# EAGLE design atmel_modular_expansion (EAGLE 6.4)
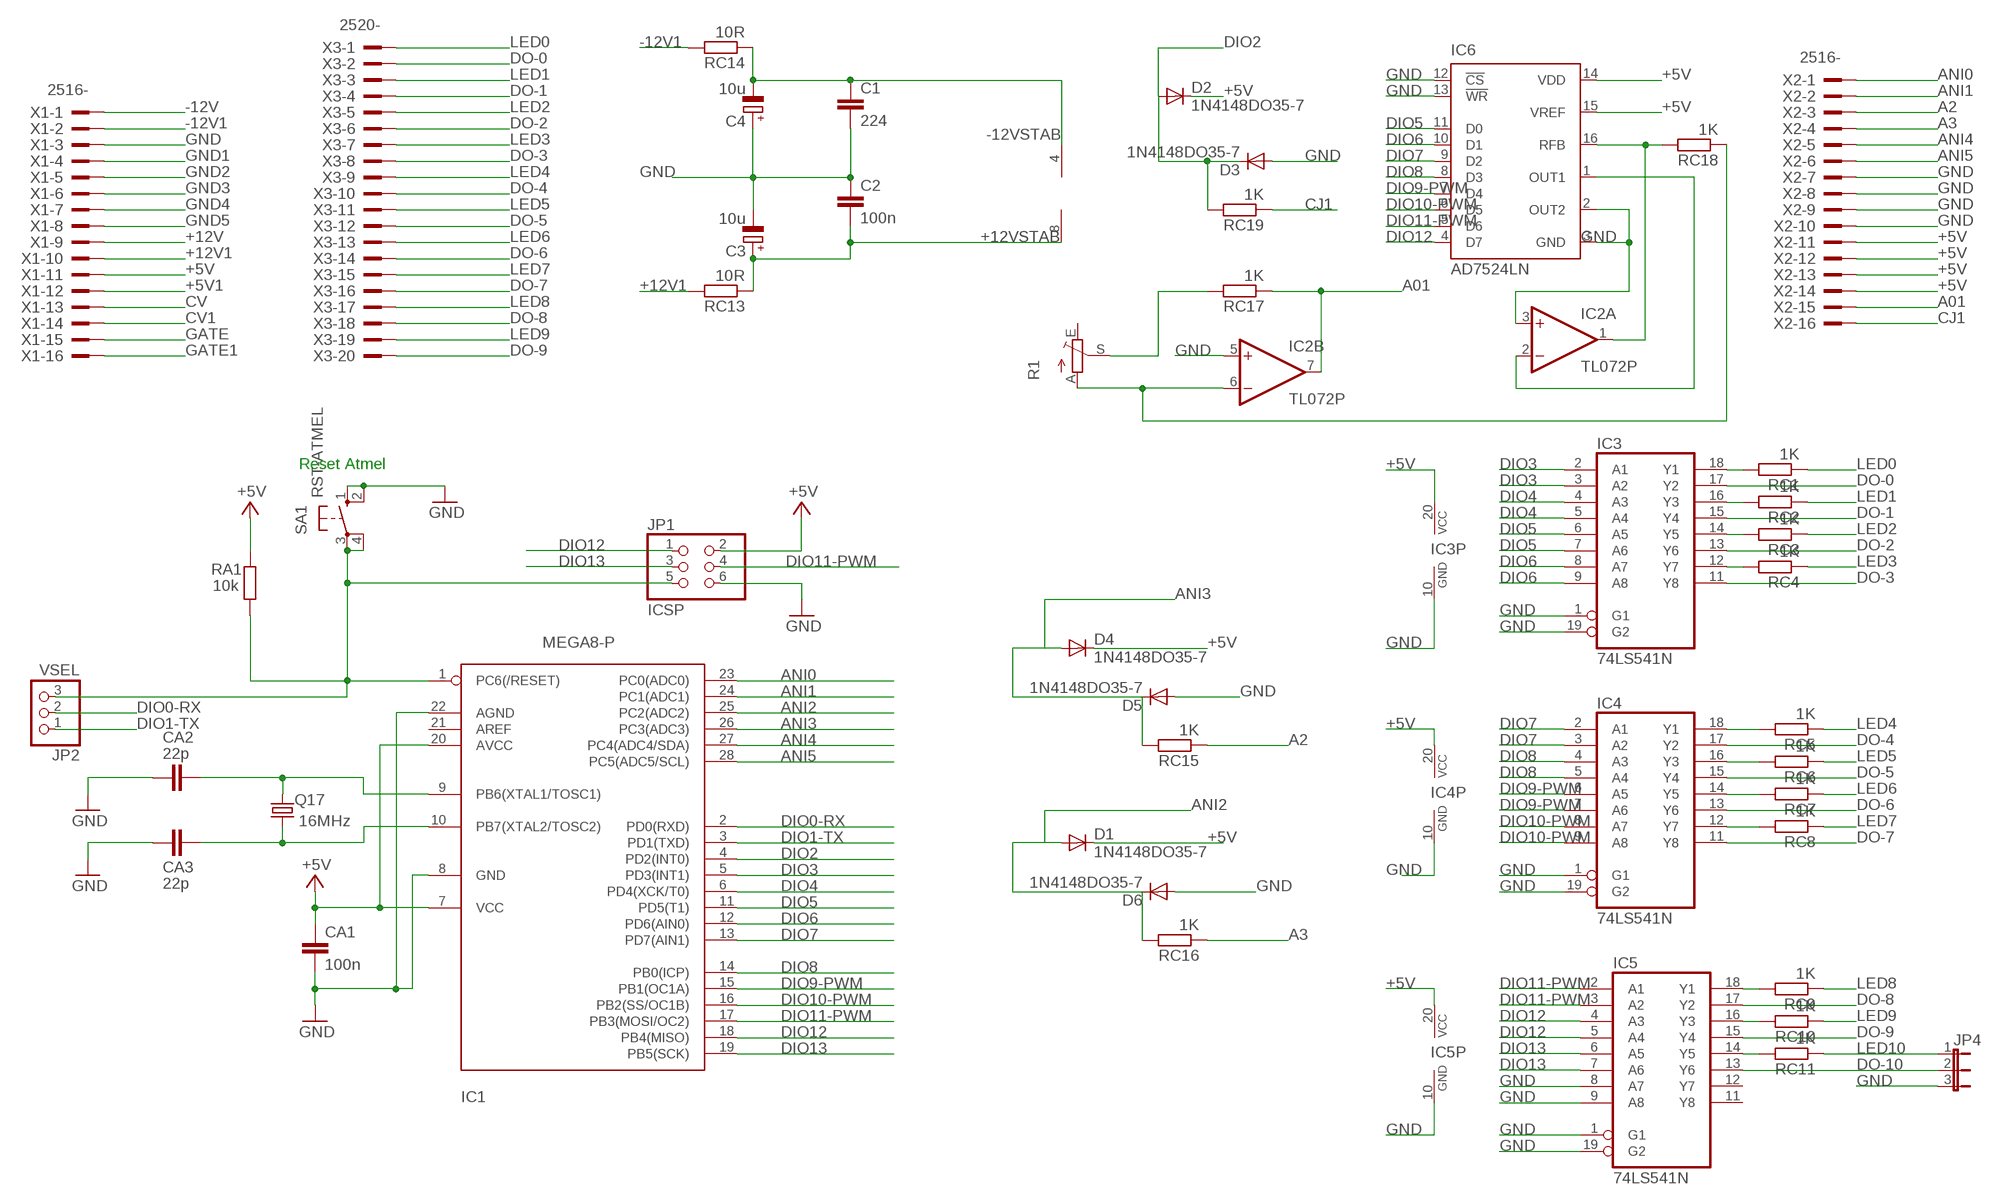
[diagram p0: schematic, sheet 1]

## Parts
C1  224  C-EU050-025X075  [C050-025X075]
C2  100n  C-EU050-025X075  [C050-025X075]
C3  10u  CPOL-EUE2.5-7  [E2,5-7]
C4  10u  CPOL-EUE2.5-7  [E2,5-7]
CA1  100n  C-EU050-025X075  [C050-025X075]
CA2  22p  C-EU050-025X075  [C050-025X075]
CA3  22p  C-EU050-025X075  [C050-025X075]
D1  1N4148DO35-7  [DO35-7]
D2  1N4148DO35-7  [DO35-7]
D3  1N4148DO35-7  [DO35-7]
D4  1N4148DO35-7  [DO35-7]
D5  1N4148DO35-7  [DO35-7]
D6  1N4148DO35-7  [DO35-7]
IC1  MEGA8-P  [DIL28-3]
IC2  TL072P  [DIL08]
IC3  74LS541N  [DIL20]
IC4  74LS541N  [DIL20]
IC5  74LS541N  [DIL20]
IC6  AD7524LN  [DIL16]
JP1  ICSP  PINHD-2X3  [2X03]
JP2  VSEL  PINHD-1X3  [1X03]
JP4  JP2E  [JP2]
Q17  16MHz  CRYSTALHC49S  [HC49/S]
R1  TRIM_EU-B64Y  [B64Y]
RA1  10k  R-EU_0207/10  [0207/10]
RC1  1K  R-EU_0207/10  [0207/10]
RC2  1K  R-EU_0207/10  [0207/10]
RC3  1K  R-EU_0207/10  [0207/10]
RC4  1K  R-EU_0207/10  [0207/10]
RC5  1K  R-EU_0207/10  [0207/10]
RC6  1K  R-EU_0207/10  [0207/10]
RC7  1K  R-EU_0207/10  [0207/10]
RC8  1K  R-EU_0207/10  [0207/10]
RC9  1K  R-EU_0207/10  [0207/10]
RC10  1K  R-EU_0207/10  [0207/10]
RC11  1K  R-EU_0207/10  [0207/10]
RC13  10R  R-EU_0207/10  [0207/10]
RC14  10R  R-EU_0207/10  [0207/10]
RC15  1K  R-EU_0207/10  [0207/10]
RC16  1K  R-EU_0207/10  [0207/10]
RC17  1K  R-EU_0207/10  [0207/10]
RC18  1K  R-EU_0207/10  [0207/10]
RC19  1K  R-EU_0207/10  [0207/10]
SA1  RST-ATMEL  10-XX  [B3F-10XX]
X1  2516-  [PAK100/2500-16]
X2  2516-  [PAK100/2500-16]
X3  2520-  [PAK100/2500-20]

## Nets
+5V [Power]: CA1.1 D1.C D2.C D4.C IC1.7(VCC) IC1.20(AVCC) IC3.20(VCC) IC4.20(VCC) IC5.20(VCC) IC6.14(VDD) IC6.15(VREF) JP1.2 RA1.1 X1.11 X2.11 X2.12 X2.13 X2.14
+5V1: X1.12
+12V: X1.9
+12V1: RC13.2 X1.10
+12VSTAB: C2.2 C3.+ IC2.8(P:V+) RC13.1
-12V: X1.1
-12V1: RC14.2 X1.2
-12VSTAB: C1.1 C4.- IC2.4(P:V-) RC14.1
A01: IC2.7(B:OUT) RC17.1 X2.15
A2: RC15.1 X2.3
A3: RC16.1 X2.4
ANI0: IC1.23(PC0(ADC0)) X2.1
ANI1: IC1.24(PC1(ADC1)) X2.2
ANI2: D1.A D6.C IC1.25(PC2(ADC2)) RC16.2
ANI3: D4.A D5.C IC1.26(PC3(ADC3)) RC15.2
ANI4: IC1.27(PC4(ADC4/SDA)) X2.5
ANI5: IC1.28(PC5(ADC5/SCL)) X2.6
CJ1: RC19.1 X2.16
CV: X1.13
CV1: X1.14
DIO0-RX: IC1.2(PD0(RXD)) JP2.2
DIO1-TX: IC1.3(PD1(TXD)) JP2.1
DIO2: D2.A D3.C IC1.4(PD2(INT0)) RC19.2
DIO3: IC1.5(PD3(INT1)) IC3.2(A1) IC3.3(A2)
DIO4: IC1.6(PD4(XCK/T0)) IC3.4(A3) IC3.5(A4)
DIO5: IC1.11(PD5(T1)) IC3.6(A5) IC3.7(A6) IC6.11(D0)
DIO6: IC1.12(PD6(AIN0)) IC3.8(A7) IC3.9(A8) IC6.10(D1)
DIO7: IC1.13(PD7(AIN1)) IC4.2(A1) IC4.3(A2) IC6.9(D2)
DIO8: IC1.14(PB0(ICP)) IC4.4(A3) IC4.5(A4) IC6.8(D3)
DIO9-PWM: IC1.15(PB1(OC1A)) IC4.6(A5) IC4.7(A6) IC6.7(D4)
DIO10-PWM: IC1.16(PB2(SS/OC1B)) IC4.8(A7) IC4.9(A8) IC6.6(D5)
DIO11-PWM: IC1.17(PB3(MOSI/OC2)) IC5.2(A1) IC5.3(A2) IC6.5(D6) JP1.4
DIO12: IC1.18(PB4(MISO)) IC5.4(A3) IC5.5(A4) IC6.4(D7) JP1.1
DIO13: IC1.19(PB5(SCK)) IC5.6(A5) IC5.7(A6) JP1.3
DO-0: IC3.17(Y2) X3.2
DO-1: IC3.15(Y4) X3.4
DO-2: IC3.13(Y6) X3.6
DO-3: IC3.11(Y8) X3.8
DO-4: IC4.17(Y2) X3.10
DO-5: IC4.15(Y4) X3.12
DO-6: IC4.13(Y6) X3.14
DO-7: IC4.11(Y8) X3.16
DO-8: IC5.17(Y2) X3.18
DO-9: IC5.15(Y4) X3.20
DO-10: IC5.13(Y6) JP4.2
GATE: X1.15
GATE1: X1.16
GND: C1.2 C2.1 C3.- C4.+ CA1.2 CA2.2 CA3.2 D3.A D5.A D6.A IC1.8(GND) IC1.22(AGND) IC2.3(A:+IN) IC2.5(B:+IN) IC3.1(G1) IC3.10(GND) IC3.19(G2) IC4.1(G1) IC4.10(GND) IC4.19(G2) IC5.1(G1) IC5.8(A7) IC5.9(A8) IC5.10(GND) IC5.19(G2) IC6.2(OUT2) IC6.3(GND) IC6.12(!CS) IC6.13(!WR) JP1.6 JP4.3 SA1.1(S) SA1.2(S1) X1.3 X2.7 X2.8 X2.9 X2.10
GND1: X1.4
GND2: X1.5
GND3: X1.6
GND4: X1.7
GND5: X1.8
LED0: RC1.1 X3.1
LED1: RC2.1 X3.3
LED2: RC3.1 X3.5
LED3: RC4.1 X3.7
LED4: RC5.1 X3.9
LED5: RC6.1 X3.11
LED6: RC7.1 X3.13
LED7: RC8.1 X3.15
LED8: RC9.1 X3.17
LED9: RC10.1 X3.19
LED10: JP4.1 RC11.1
N$1: IC3.18(Y1) RC1.2
N$3: IC3.16(Y3) RC2.2
N$4: IC3.14(Y5) RC3.2
N$5: CA2.1 IC1.9(PB6(XTAL1/TOSC1)) Q17.2
N$6: CA3.1 IC1.10(PB7(XTAL2/TOSC2)) Q17.1
N$7: IC3.12(Y7) RC4.2
N$8: IC4.18(Y1) RC5.2
N$9: IC4.16(Y3) RC6.2
N$10: IC4.14(Y5) RC7.2
N$11: IC4.12(Y7) RC8.2
N$12: IC5.18(Y1) RC9.2
N$13: IC5.16(Y3) RC10.2
N$14: IC5.14(Y5) RC11.2
N$17: IC2.6(B:-IN) R1.A RC18.1
N$18: IC2.2(A:-IN) IC6.1(OUT1)
N$19: R1.S RC17.2
N$20: IC2.1(A:OUT) IC6.16(RFB) RC18.2
RST: IC1.1(PC6(/RESET)) JP1.5 JP2.3 RA1.2 SA1.3(P) SA1.4(P1)
Unconnected: IC1.21(AREF) IC5.11(Y8) IC5.12(Y7) R1.E

## Notes on the sheet
- Reset Atmel

## Library data of the parts
C1 C2 CA1-CA3 = rcl:C-EU: CAPACITOR, European symbol
C3 C4 = rcl:CPOL-EU: POLARIZED CAPACITOR, European symbol
D1-D6 = diode:1N4148: DIODE high speed (Philips)
IC1 = atmel:MEGA8-P: MICROCONTROLLER 8 Kbytes FLASH, 1 kbytes SRAM, 512 bytes EEPROM, USART, 4-channel 10 bit ADC, 2-channel 8 bit ADC Pin compatible with Atmega48, ATMega88, ATMega168 Source: avr.lbr
IC2 = linear:TL072: OP AMP
IC3-IC5 = 74xx-eu:74*541: Octal BUFFER and LINE DRIVER, 3-state
IC6 = analog-devices:AD7524*: 8-Bit Buffered Multiplying DAC Source: http://www.analog.com/UploadedFiles/Data_Sheets/888358036ad7524.pdf; MF: ALTERA CORPORATION; MPN: AD7524LNZ; OC_FARNELL: 9605401; OC_NEWARK: 59K4974
JP1 = pinhead:PINHD-2X3: PIN HEADER
JP2 = pinhead:PINHD-1X3: PIN HEADER
JP4 = jumper:JP2E: JUMPER
Q17 = crystal:CRYSTAL: CRYSTAL
R1 = pot:TRIM_EU-: POTENTIOMETER
RA1 RC1-RC11 RC13-RC19 = rcl:R-EU_: RESISTOR, European symbol
SA1 = switch-omron:10-XX: OMRON SWITCH
X1 X2 = con-3m:2516-: 3M (TM) Pak 100 4-Wall Header Source: 3M; OC_FARNELL: unknown; OC_NEWARK: unknown
X3 = con-3m:2520-: 3M (TM) Pak 100 4-Wall Header Source: 3M; OC_FARNELL: unknown; OC_NEWARK: unknown

## Net classes
1 Leds: width 0.61 mm, drill 0.508 mm, clearance 0.305 mm
2 Power: width 0.61 mm, drill 0.508 mm, clearance 0.305 mm

## Board
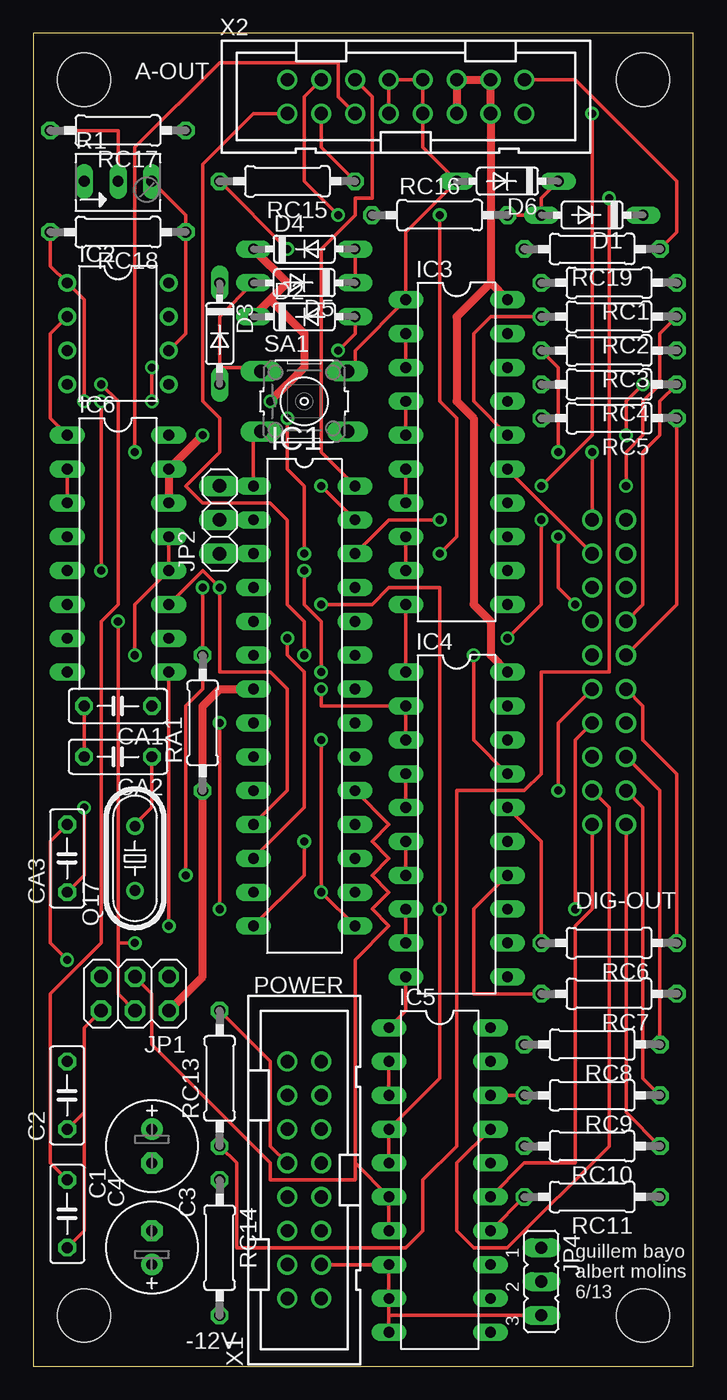
[diagram p1: board, top side]
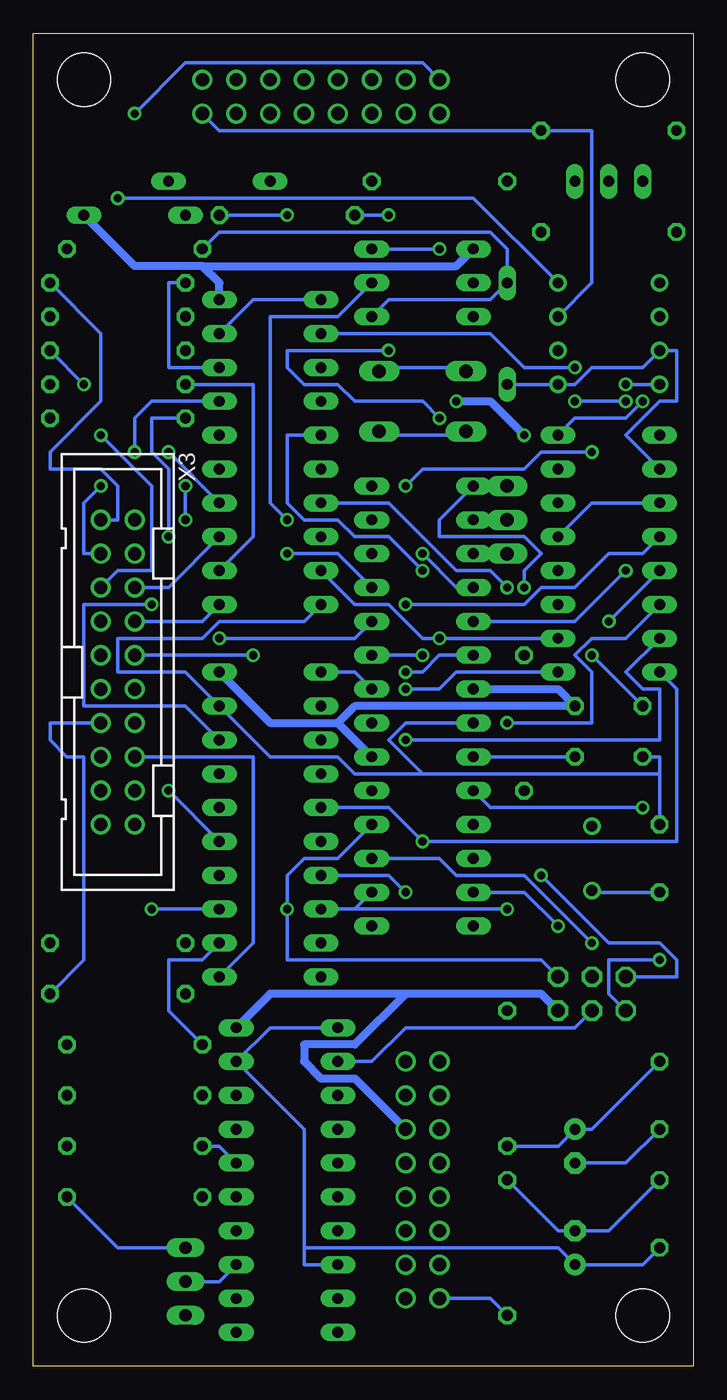
[diagram p2: board, bottom side, seen from below]

Size 49.51 x 100 mm. Coordinates in mm from the lower left corner, seen from the top.
Outline: 0,0 49.51,0 49.51,100 0,100 0,0
Copper layers (1*16): Top 0.035mm / dielectric 1.5mm / Bottom 0.035mm
Design rules "default": minimum track width 10mil, minimum drill 24mil, track to track 8mil, track to pad 8mil, pad to pad 8mil, via to via 8mil, smd to smd 8mil, copper to edge 40mil, drill to drill 8mil, minimum pad ring 10mil, minimum via ring 8mil, stop-mask expansion 4mil, vias tented up to drill 0mil, thermal gap 10mil
Holes 4 mm at 3.81,96.52 45.72,96.52 3.81,3.81 45.72,3.81

### Footprints (pad centres in the part's own frame; a part is rotated, then mirrored left to right if it is on the bottom)
C050-025X075 = drill 0.813 octagon: 1 -2.54,0; 2 2.54,0
E2,5-7 = drill 0.813 pad 1.6: + -1.27,0 | drill 0.813 pad 1.6 octagon: - 1.27,0
DO35-7 = drill 0.813 long: A 3.81,0; C -3.81,0
DIL28-3 = drill 0.813 long: 1 -16.51,-3.81; 2 -13.97,-3.81; 3 -11.43,-3.81; 4 -8.89,-3.81; 5 -6.35,-3.81; 6 -3.81,-3.81; 7 -1.27,-3.81; 8 1.27,-3.81; 9 3.81,-3.81; 10 6.35,-3.81; 11 8.89,-3.81; 12 11.43,-3.81; 13 13.97,-3.81; 14 16.51,-3.81; 15 16.51,3.81; 16 13.97,3.81; 17 11.43,3.81; 18 8.89,3.81; 19 6.35,3.81; 20 3.81,3.81; 21 1.27,3.81; 22 -1.27,3.81; 23 -3.81,3.81; 24 -6.35,3.81; 25 -8.89,3.81; 26 -11.43,3.81; 27 -13.97,3.81; 28 -16.51,3.81
DIL08 = drill 0.813 pad 1.27: 1 -3.81,-3.81; 2 -1.27,-3.81; 3 1.27,-3.81; 4 3.81,-3.81; 5 3.81,3.81; 6 1.27,3.81; 7 -1.27,3.81; 8 -3.81,3.81
DIL20 = drill 0.813 long: 1 -11.43,-3.81; 2 -8.89,-3.81; 3 -6.35,-3.81; 4 -3.81,-3.81; 5 -1.27,-3.81; 6 1.27,-3.81; 7 3.81,-3.81; 8 6.35,-3.81; 9 8.89,-3.81; 10 11.43,-3.81; 11 11.43,3.81; 12 8.89,3.81; 13 6.35,3.81; 14 3.81,3.81; 15 1.27,3.81; 16 -1.27,3.81; 17 -3.81,3.81; 18 -6.35,3.81; 19 -8.89,3.81; 20 -11.43,3.81
DIL16 = drill 0.813 long: 1 -8.89,-3.81; 2 -6.35,-3.81; 3 -3.81,-3.81; 4 -1.27,-3.81; 5 1.27,-3.81; 6 3.81,-3.81; 7 6.35,-3.81; 8 8.89,-3.81; 9 8.89,3.81; 10 6.35,3.81; 11 3.81,3.81; 12 1.27,3.81; 13 -1.27,3.81; 14 -3.81,3.81; 15 -6.35,3.81; 16 -8.89,3.81
2X03 = drill 1.016 octagon: 1 -2.54,-1.27; 2 -2.54,1.27; 3 0,-1.27; 4 0,1.27; 5 2.54,-1.27; 6 2.54,1.27
1X03 = drill 1.016 long: 1 -2.54,0; 2 0,0; 3 2.54,0
JP2 = drill 0.914 long: 1 -2.54,0; 2 0,0; 3 2.54,0
HC49/S = drill 0.813: 1 -2.413,0; 2 2.413,0
B64Y = drill 0.813 long: A 2.54,0; E -2.54,0; S 0,0
0207/10 = drill 0.813 octagon: 1 -5.08,0; 2 5.08,0
B3F-10XX = drill 1.016 long: 1 -3.251,2.261; 2 3.251,2.261; 3 -3.251,-2.261; 4 3.251,-2.261
PAK100/2500-16 = drill 1 pad 1.422: 1 -8.89,-1.27; 2 -8.89,1.27; 3 -6.35,-1.27; 4 -6.35,1.27; 5 -3.81,-1.27; 6 -3.81,1.27; 7 -1.27,-1.27; 8 -1.27,1.27; 9 1.27,-1.27; 10 1.27,1.27; 11 3.81,-1.27; 12 3.81,1.27; 13 6.35,-1.27; 14 6.35,1.27; 15 8.89,-1.27; 16 8.89,1.27
PAK100/2500-20 = drill 1 pad 1.422: 1 -11.43,-1.27; 2 -11.43,1.27; 3 -8.89,-1.27; 4 -8.89,1.27; 5 -6.35,-1.27; 6 -6.35,1.27; 7 -3.81,-1.27; 8 -3.81,1.27; 9 -1.27,-1.27; 10 -1.27,1.27; 11 1.27,-1.27; 12 1.27,1.27; 13 3.81,-1.27; 14 3.81,1.27; 15 6.35,-1.27; 16 6.35,1.27; 17 8.89,-1.27; 18 8.89,1.27; 19 11.43,-1.27; 20 11.43,1.27

### Placement (x,y rotation side)
C1  2.54,11.43 270 top
C2  2.54,20.32 90 top
C3  8.89,16.51 270 top
C4  8.89,8.89 90 top
CA1  6.35,49.53 180 top
CA2  6.35,45.72 180 top
CA3  2.54,38.1 90 top
D1  41.91,86.36 180 top
D2  20.32,78.74 0 top
D3  13.97,77.47 270 top
D4  20.32,83.82 0 top
D5  20.32,81.28 180 top
D6  35.56,88.9 180 top
IC1  20.32,49.53 270 top
IC2  6.35,77.47 270 top
IC3  31.75,68.58 270 top
IC4  31.75,40.64 270 top
IC5  30.48,13.97 270 top
IC6  6.35,60.96 270 top
JP1  7.62,27.94 180 top
JP2  13.97,63.5 90 top
JP4  38.1,6.35 270 top
Q17  7.62,38.1 90 top
R1  6.35,88.9 0 top
RA1  12.7,48.26 90 top
RC1  43.18,81.28 180 top
RC2  43.18,78.74 180 top
RC3  43.18,76.2 180 top
RC4  43.18,73.66 180 top
RC5  43.18,71.12 180 top
RC6  43.18,31.75 180 top
RC7  43.18,27.94 180 top
RC8  41.91,24.13 180 top
RC9  41.91,20.32 180 top
RC10  41.91,16.51 180 top
RC11  41.91,12.7 180 top
RC13  13.97,21.59 90 top
RC14  13.97,8.89 270 top
RC15  19.05,88.9 180 top
RC16  30.48,86.36 0 top
RC17  6.35,92.71 180 top
RC18  6.35,85.09 180 top
RC19  41.91,83.82 180 top
SA1  20.32,72.39 0 top
X1  20.32,13.97 90 top
X2  27.94,95.25 0 top
X3  43.18,52.07 270 bottom

### Tracks (layer width: path | path; a pad name or v marks a point on that pad's centre or on a via)
+5V  (via drill 0.61)
  Top 0.61: JP1.2 12.7,29.21 RA1.1 12.7,49.53 13.97,50.8 IC1.7 | IC6.14 IC6.15 v12.7,69.85 | 17.78,80.01 19.05,81.28 D4.C | 17.78,80.01 D2.C | v17.78,72.39 20.32,74.93 20.32,77.47 17.78,80.01 | X2.11 X2.12 X2.14 X2.13 34.29,81.28 | 34.29,81.28 IC3.20 | IC4.20 34.29,53.34 34.29,55.88 33.02,57.15 33.02,71.12 31.75,72.39 31.75,78.74 34.29,81.28
  Bottom 0.61: 26.67,48.26 IC1.20 | 26.67,48.26 31.75,48.26 IC4.20 | IC1.7 10.16,50.8 CA1.1 25.4,49.53 26.67,48.26 | IC5.20 31.75,27.94 21.59,27.94 | 21.59,27.94 11.43,27.94 JP1.2 | X1.11 25.4,21.59 27.94,21.59 29.21,22.86 29.21,24.13 25.4,24.13 21.59,27.94 | v12.7,69.85 15.24,72.39 v17.78,72.39 | D1.C 41.91,82.55 36.83,82.55 | 36.83,82.55 35.56,81.28 IC3.20 | D4.C 17.78,82.55 36.83,82.55
+12V1
  Top 0.254: RC13.2 17.78,22.86 17.78,16.51 X1.10
+12VSTAB  (via drill 0.61)
  Top 0.254: v43.18,87.63 43.18,52.07 38.1,52.07 38.1,44.45 36.83,43.18 31.75,43.18 31.75,16.51 29.21,13.97 29.21,10.16 27.94,8.89 15.24,8.89 15.24,15.24 RC13.1
  Bottom 0.254: C2.2 7.62,17.78 C3.+ 10.16,16.51 RC13.1 | IC2.8 16.51,87.63 v43.18,87.63
-12V1
  Bottom 0.254: RC14.2 15.24,5.08 X1.2
-12VSTAB  (via drill 0.61)
  Top 0.254: v5.08,73.66 6.35,72.39 6.35,57.15 5.08,55.88 5.08,31.75 1.27,27.94 1.27,15.24 C1.1
  Bottom 0.254: C1.1 6.35,10.16 C4.- 10.16,10.16 RC14.1 | v5.08,73.66 IC2.4
A01
  Bottom 0.254: IC2.7 7.62,81.28 7.62,92.71 RC17.1 35.56,92.71 X2.15
A2
  Top 0.254: RC15.1 21.59,91.44 X2.3
A3  (via drill 0.61)
  Top 0.254: v22.86,86.36 20.32,88.9 20.32,95.25 X2.4
  Bottom 0.254: v22.86,86.36 RC16.1
ANI0  (via drill 0.61)
  Top 0.254: v20.32,53.34 20.32,55.88 19.05,57.15 19.05,63.5 17.78,64.77 12.7,64.77 11.43,66.04 13.97,68.58 13.97,71.12 12.7,72.39 12.7,90.17 16.51,93.98 X2.1
  Bottom 0.254: v20.32,53.34 IC1.23
ANI1  (via drill 0.61)
  Top 0.254: v35.56,54.61 38.1,57.15 v38.1,63.5 | v38.1,66.04 41.91,69.85 v41.91,93.98
  Bottom 0.254: IC1.24 25.4,54.61 v35.56,54.61 | v38.1,66.04 v38.1,63.5 | v41.91,93.98 38.1,97.79 20.32,97.79 X2.2
ANI2  (via drill 0.61)
  Top 0.254: v30.48,60.96 31.75,62.23 31.75,71.12 30.48,72.39 v30.48,86.36 | RC16.2 D1.A 38.1,87.63 D6.C
  Bottom 0.254: IC1.25 26.67,60.96 v30.48,60.96 | RC16.2 v30.48,86.36
ANI3  (via drill 0.61)
  Top 0.254: IC1.26 26.67,63.5 v30.48,63.5 | D5.C D4.A | v19.05,83.82 RC15.2
  Bottom 0.254: v30.48,63.5 31.75,64.77 31.75,78.74 26.67,78.74 D5.C | D4.A v19.05,83.82
ANI4  (via drill 0.61)
  Top 0.254: v21.59,66.04 IC1.27 | v7.62,68.58 7.62,91.44 13.97,97.79 22.86,97.79 22.86,95.25 X2.5
  Bottom 0.254: v21.59,66.04 20.32,67.31 12.7,67.31 11.43,68.58 v7.62,68.58
ANI5
  Top 0.254: IC1.28 21.59,68.58 21.59,83.82 24.13,86.36 24.13,87.63 25.4,87.63 25.4,95.25 X2.6
CJ1
  Top 0.254: RC19.1 48.26,85.09 48.26,88.9 40.64,96.52 X2.16
DIO0-RX
  Top 0.254: JP2.2 IC1.2
DIO1-TX
  Top 0.254: JP2.1 IC1.3
DIO2  (via drill 0.61)
  Top 0.254: v20.32,60.96 20.32,66.04 19.05,67.31 v19.05,71.12 | v22.86,76.2 24.13,77.47 D2.A
  Bottom 0.254: IC1.4 17.78,58.42 v20.32,60.96 | v19.05,71.12 20.32,72.39 25.4,72.39 26.67,73.66 29.21,73.66 30.48,74.93 30.48,76.2 v22.86,76.2 | D2.A 22.86,80.01 15.24,80.01 D3.C 13.97,83.82 15.24,85.09 35.56,85.09 RC19.2
DIO3  (via drill 0.61)
  Top 0.254: v5.08,72.39 v5.08,59.69 | v8.89,74.93 v8.89,72.39 | IC3.2 IC3.3
  Bottom 0.254: IC1.5 8.89,55.88 v5.08,59.69 | v8.89,72.39 v5.08,72.39 | v8.89,74.93 12.7,74.93 15.24,77.47 IC3.2
DIO4  (via drill 0.61)
  Top 0.254: v21.59,52.07 21.59,55.88 20.32,57.15 v20.32,59.69 | IC3.5 IC3.4
  Bottom 0.254: IC1.6 19.05,53.34 20.32,52.07 v21.59,52.07 | v20.32,59.69 22.86,62.23 25.4,62.23 26.67,63.5 29.21,63.5 30.48,64.77 30.48,69.85 IC3.5
DIO5  (via drill 0.61)
  Top 0.254: IC3.6 IC3.7 | IC1.11 19.05,43.18 19.05,50.8 17.78,52.07 13.97,52.07 v13.97,58.42 12.7,59.69 IC6.11
  Bottom 0.254: IC3.7 22.86,64.77 17.78,59.69 15.24,59.69 v13.97,58.42
DIO6  (via drill 0.61)
  Top 0.254: IC1.12 20.32,41.91 20.32,52.07 19.05,53.34 v19.05,54.61 | IC3.9 IC3.8
  Bottom 0.254: IC6.10 v19.05,54.61 20.32,54.61 22.86,57.15 25.4,57.15 IC3.9
DIO7  (via drill 0.61)
  Top 0.254: IC4.3 IC4.2 21.59,49.53 v21.59,50.8 | v10.16,33.02 IC6.9
  Bottom 0.254: v10.16,33.02 12.7,35.56 IC1.13 | v21.59,50.8 19.05,50.8 17.78,52.07 IC6.9
DIO8  (via drill 0.61)
  Top 0.254: IC1.14 20.32,36.83 v20.32,39.37 | IC4.5 IC4.4
  Bottom 0.254: IC4.5 22.86,41.91 v20.32,39.37 1.27,39.37 1.27,50.8 IC6.8
DIO9-PWM  (via drill 0.61)
  Top 0.254: IC1.15 v21.59,35.56 v21.59,46.99 | IC4.7 IC4.6
  Bottom 0.254: v21.59,35.56 22.86,36.83 IC4.7 | IC6.7 5.08,52.07 3.81,50.8 2.54,50.8 2.54,46.99 v21.59,46.99
DIO10-PWM  (via drill 0.61)
  Top 0.254: IC4.8 IC4.9 | v13.97,34.29 v13.97,48.26
  Bottom 0.254: 25.4,34.29 IC1.16 | IC4.8 25.4,34.29 | IC6.6 5.08,54.61 7.62,54.61 8.89,53.34 7.62,52.07 7.62,48.26 v13.97,48.26 | 25.4,34.29 v13.97,34.29
DIO11-PWM  (via drill 0.61)
  Top 0.254: IC5.2 IC5.3 | 6.35,31.75 6.35,27.94 JP1.4 | 6.35,31.75 v6.35,55.88 | 6.35,31.75 v7.62,31.75
  Bottom 0.254: v6.35,55.88 IC6.5 | IC1.17 19.05,38.1 17.78,36.83 12.7,36.83 v7.62,31.75 | IC5.2 24.13,22.86 21.59,25.4 8.89,25.4 JP1.4
DIO12  (via drill 0.61)
  Top 0.254: IC5.5 IC5.4 30.48,21.59 v30.48,34.29 30.48,58.42 26.67,58.42 25.4,57.15 v21.59,57.15
  Bottom 0.254: IC1.18 26.67,38.1 29.21,38.1 30.48,36.83 v30.48,34.29 30.48,30.48 11.43,30.48 JP1.1 | IC6.4 3.81,60.96 6.35,60.96 8.89,58.42 11.43,58.42 12.7,57.15 v21.59,57.15
DIO13
  Top 0.254: IC5.7 IC5.6 24.13,15.24 | IC1.19 26.67,40.64 25.4,39.37 26.67,38.1 25.4,36.83 26.67,35.56 25.4,34.29 26.67,33.02 24.13,30.48 24.13,15.24 | JP1.3 8.89,27.94 8.89,24.13 17.78,15.24 17.78,13.97 24.13,13.97 24.13,15.24
DO-0  (via drill 0.61)
  Top 0.254: X3.2 v41.91,68.58
  Bottom 0.254: IC3.17 40.64,72.39 41.91,71.12 v41.91,68.58
DO-1
  Top 0.254: X3.4 IC3.15
DO-2
  Bottom 0.254: IC3.13 39.37,58.42 X3.6
DO-3
  Bottom 0.254: IC3.11 36.83,55.88 X3.8
DO-4  (via drill 0.61)
  Top 0.254: IC4.17 33.02,46.99 v33.02,53.34
  Bottom 0.254: X3.10 v33.02,53.34
DO-5  (via drill 0.61)
  Top 0.254: v39.37,43.18 39.37,48.26 X3.12
  Bottom 0.254: v39.37,43.18 IC4.15
DO-6  (via drill 0.61)
  Top 0.254: v40.64,34.29 40.64,46.99 X3.14
  Bottom 0.254: v40.64,34.29 IC4.13
DO-7
  Bottom 0.254: IC4.11 33.02,31.75 33.02,45.72 X3.16
DO-8
  Top 0.254: IC5.17 31.75,15.24 31.75,10.16 33.02,8.89 35.56,8.89 43.18,16.51 43.18,41.91 X3.18
DO-9
  Top 0.254: IC5.15 36.83,15.24 40.64,15.24 40.64,33.02 41.91,34.29 X3.20
DO-10
  Bottom 0.254: IC5.13 35.56,6.35 JP4.2
GND  (via drill 0.61)
  Top 0.254: JP1.6 3.81,25.4 3.81,19.05 | C2.1 3.81,19.05 | C1.2 3.81,10.16 3.81,19.05 | IC5.1 27.94,26.67 IC4.10 | 26.67,3.81 IC5.9 IC5.8 X1.3 | 26.67,3.81 IC5.10 | 26.67,3.81 JP4.3 | IC4.1 IC3.10 | CA2.2 CA1.2 | X2.7 X2.8 X2.10 X2.9 29.21,91.44 D6.A 27.94,85.09 IC3.1 24.13,76.2 24.13,74.93 SA1.2 | IC6.13 IC6.12 7.62,57.15 v7.62,53.34 | IC6.2 IC6.3 | D5.A 13.97,78.74 13.97,74.93 | 13.97,74.93 16.51,74.93 SA1.1 | 13.97,74.93 D3.A | v2.54,30.48 1.27,31.75 1.27,39.37 CA3.2
  Bottom 0.254: C1.2 3.81,7.62 C4.+ 10.16,8.89 29.21,8.89 | C2.1 5.08,15.24 C3.- | IC5.1 31.75,25.4 IC5.19 29.21,17.78 29.21,8.89 | 29.21,8.89 29.21,7.62 IC5.8 | IC1.22 25.4,52.07 IC4.1 | 2.54,44.45 2.54,45.72 CA2.2 | 2.54,44.45 CA3.2 | IC1.8 21.59,48.26 22.86,46.99 20.32,44.45 | 2.54,44.45 20.32,44.45 | 20.32,44.45 25.4,44.45 26.67,45.72 31.75,45.72 IC4.19 38.1,52.07 43.18,52.07 43.18,54.61 36.83,54.61 35.56,55.88 29.21,55.88 IC3.10 | IC3.19 33.02,80.01 IC3.1 | IC6.13 7.62,64.77 IC6.3 | D3.A IC2.5 8.89,73.66 7.62,74.93 3.81,74.93 IC2.3 1.27,76.2 1.27,72.39 2.54,72.39 5.08,69.85 IC6.2 | SA1.2 22.86,74.93 17.78,74.93 SA1.1 | v7.62,53.34 CA1.2 | JP1.6 6.35,27.94 6.35,30.48 v2.54,30.48
LED0
  Bottom 0.254: RC1.1 44.45,77.47 44.45,72.39 48.26,68.58 48.26,67.31 44.45,67.31 43.18,66.04 43.18,63.5 X3.1
LED1  (via drill 0.61)
  Top 0.254: RC2.1 46.99,77.47 46.99,73.66 45.72,72.39 45.72,69.85 44.45,68.58 v44.45,66.04
  Bottom 0.254: v44.45,66.04 45.72,64.77 45.72,60.96 X3.3
LED2  (via drill 0.61)
  Top 0.254: v45.72,73.66 44.45,72.39 v44.45,69.85
  Bottom 0.254: v45.72,73.66 RC3.1 | v44.45,69.85 40.64,66.04 40.64,59.69 43.18,59.69 X3.5
LED3
  Top 0.254: RC4.1 46.99,72.39 46.99,69.85 45.72,68.58 45.72,57.15 X3.7
LED4
  Top 0.254: RC5.1 48.26,57.15 X3.9
LED5
  Top 0.254: RC6.1 48.26,44.45 45.72,46.99 45.72,49.53 X3.11
LED6
  Bottom 0.254: RC7.1 45.72,30.48 45.72,45.72 46.99,45.72 48.26,46.99 48.26,48.26 X3.13
LED7
  Top 0.254: RC8.1 46.99,43.18 X3.15
LED8
  Top 0.254: RC9.1 45.72,21.59 45.72,41.91 X3.17
LED9
  Top 0.254: RC10.1 44.45,19.05 X3.19
LED10
  Bottom 0.254: RC11.1 43.18,8.89 JP4.1
N$1
  Bottom 0.254: IC3.18 39.37,74.93 39.37,81.28 RC1.2
N$3
  Top 0.254: IC3.16 33.02,72.39 33.02,77.47 34.29,78.74 RC2.2
N$4  (via drill 0.61)
  Top 0.254: v39.37,68.58 39.37,74.93 RC3.2
  Bottom 0.254: v39.37,68.58 IC3.14
N$5
  Top 0.254: CA2.1 8.89,41.91 7.62,40.64 Q17.2
  Bottom 0.254: CA2.1 IC1.9
N$6  (via drill 0.61)
  Top 0.254: v3.81,41.91 3.81,36.83 CA3.1
  Bottom 0.254: CA3.1 7.62,35.56 Q17.1 | IC1.10 15.24,41.91 v3.81,41.91
N$7
  Bottom 0.254: IC3.12 33.02,62.23 33.02,73.66 RC4.2
N$8  (via drill 0.61)
  Top 0.254: v40.64,57.15 39.37,58.42 v39.37,62.23
  Bottom 0.254: IC4.18 38.1,49.53 45.72,49.53 45.72,57.15 v40.64,57.15 | v39.37,62.23 39.37,67.31 40.64,68.58 40.64,71.12 RC5.2
N$9
  Top 0.254: RC6.2 38.1,39.37 IC4.16
N$10
  Top 0.254: RC7.2 33.02,27.94 33.02,34.29 IC4.14
N$11
  Bottom 0.254: RC8.2 39.37,26.67 39.37,30.48 36.83,30.48 IC4.12
N$12
  Top 0.254: RC9.2 IC5.18
N$13
  Bottom 0.254: IC5.16 35.56,16.51 RC10.2
N$14
  Top 0.254: RC11.2 IC5.14
N$17
  Top 0.254: IC2.6 11.43,77.47 RC18.1 11.43,86.36 R1.A
N$18
  Top 0.254: IC6.1 1.27,71.12 1.27,77.47 IC2.2
N$19
  Top 0.254: RC17.2 6.35,92.71 R1.S
N$20  (via drill 0.61)
  Top 0.254: RC18.2 1.27,82.55 IC2.1 3.81,80.01 v3.81,72.39
  Bottom 0.254: IC6.16 8.89,71.12 5.08,71.12 v3.81,72.39
RST  (via drill 0.61)
  Top 0.254: JP2.3 IC1.1 16.51,69.85 SA1.3 | v11.43,36.83 11.43,49.53 12.7,50.8 RA1.2 v12.7,58.42
  Bottom 0.254: SA1.4 22.86,69.85 17.78,69.85 SA1.3 | v11.43,36.83 6.35,31.75 2.54,31.75 1.27,30.48 1.27,29.21 JP1.5 | IC1.1 19.05,63.5 19.05,62.23 12.7,62.23 11.43,60.96 12.7,59.69 v12.7,58.42

### Text on the board
tNames: A-OUT | DIG-OUT | POWER | guillem bayo / albert molins / 6/13 | -12V